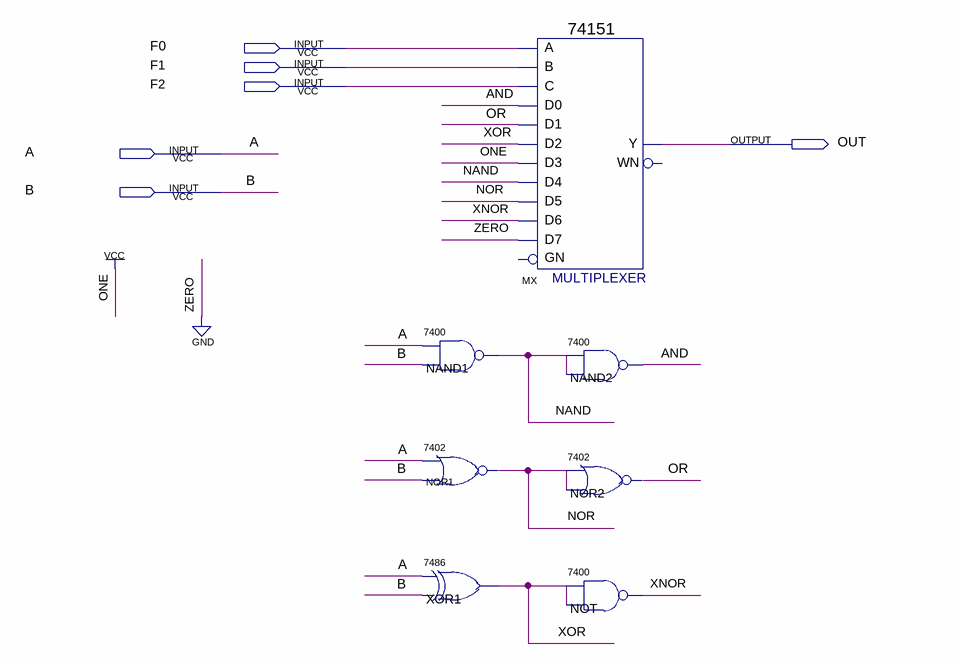
[diagram p0: schematic sheet]
// Quartus schematic logic_unit.bdf as structural Verilog: 7 symbols, 6 pins
module logic_unit (
  input  F0,
  input  F1,
  input  F2,
  input  A,
  input  B,
  output OUT
);

  wire AND, NAND, NOR, OR, XNOR, XOR;

  \7400  NAND1 (.\3 (B), .\2 (A), .\1 (NAND));
  \7402  NOR1 (.\2 (A), .\3 (B), .\1 (NOR));
  \7486  XOR1 (.\2 (A), .\3 (B), .\1 (XOR));
  \74151  MX (
    .C(F2), .B(F1), .A(F0), .D5(NOR), .D0(AND), .D1(OR), .D4(NAND), .D3(1'b1), .D2(XOR), .D6(XNOR),
    .D7(1'b0), .Y(OUT));  // open: GN, WN
  \7400  NAND2 (.\3 (NAND), .\2 (NAND), .\1 (AND));
  \7402  NOR2 (.\2 (NOR), .\3 (NOR), .\1 (OR));
  \7400  NOT (.\3 (XOR), .\2 (XOR), .\1 (XNOR));
endmodule
